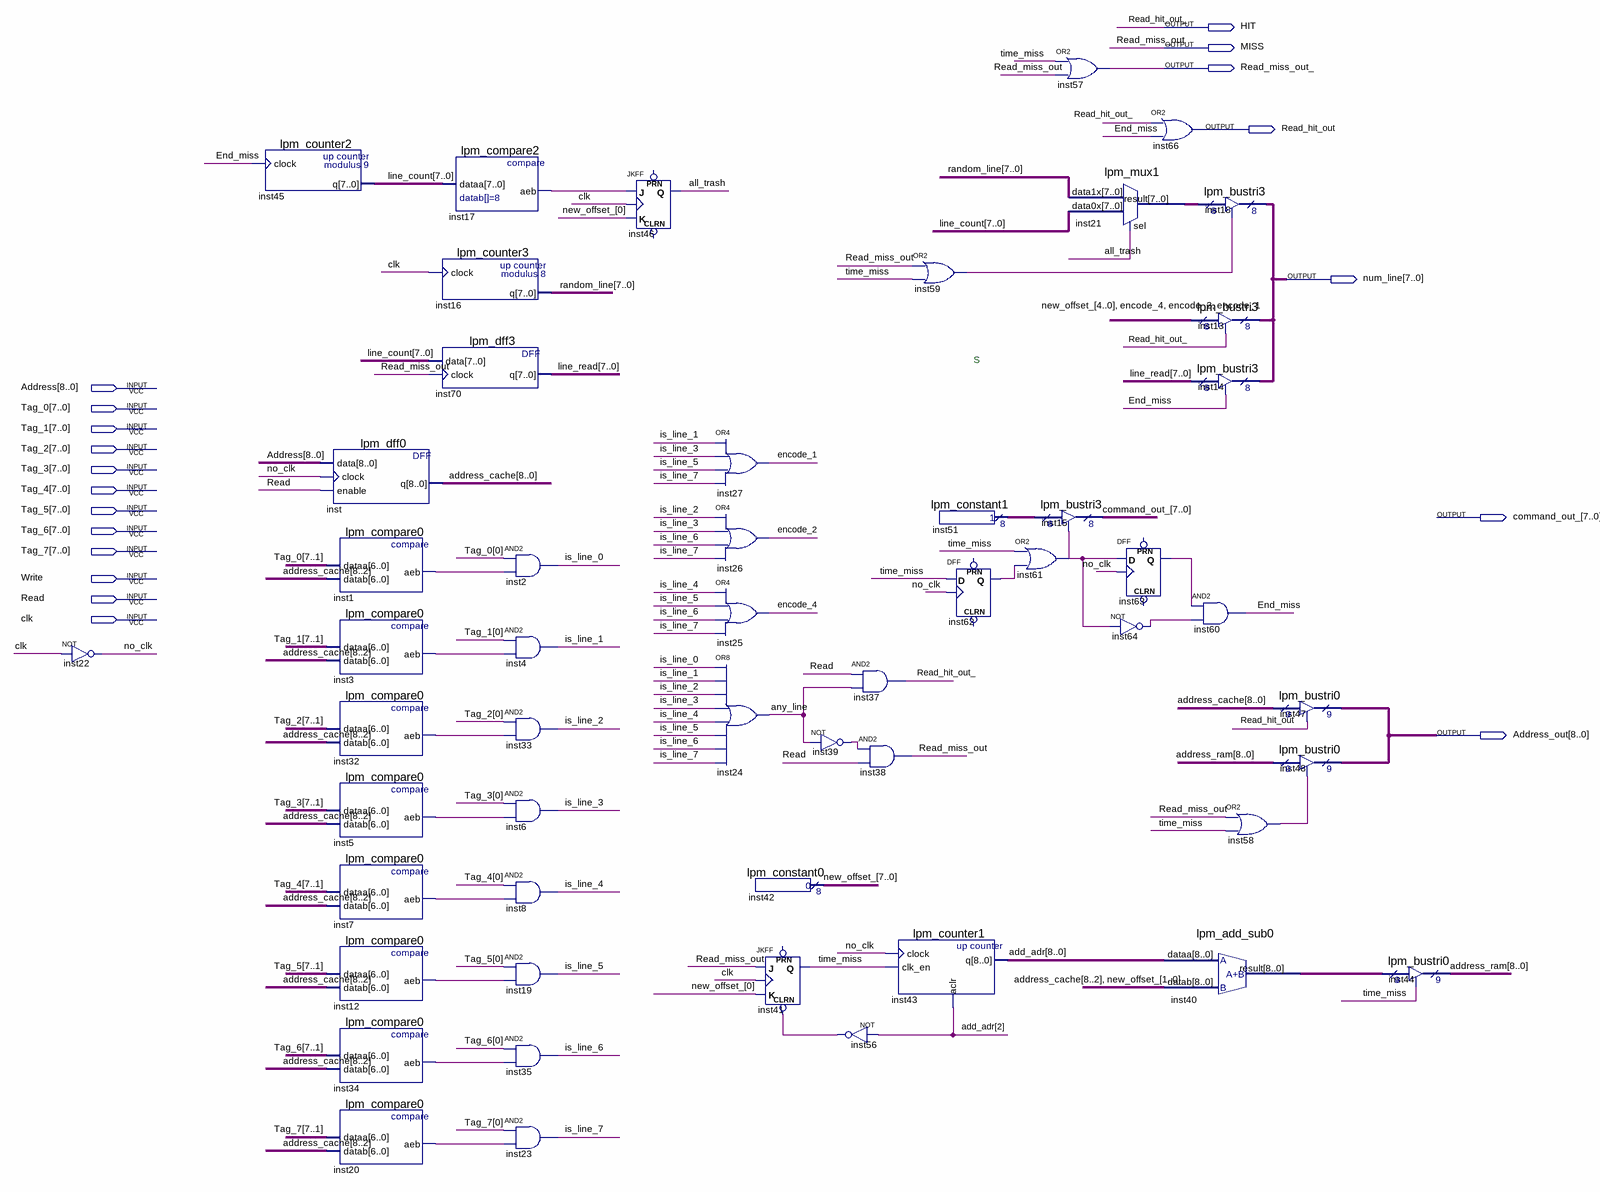
[diagram p0: schematic sheet]
// Quartus schematic cache_control.bdf as structural Verilog: 53 symbols, 19 pins
module cache_control (
  input  [8:0] Address,
  input  [7:0] Tag_0,
  input  [7:0] Tag_1,
  input  [7:0] Tag_2,
  input  [7:0] Tag_3,
  input  [7:0] Tag_4,
  input  [7:0] Tag_5,
  input  [7:0] Tag_6,
  input  [7:0] Tag_7,
  input  Write,
  input  Read,
  input  clk,
  output HIT,
  output MISS,
  output Read_miss_out_,
  output Read_hit_out,
  output [7:0] num_line,
  output [7:0] command_out_,
  output [8:0] Address_out
);

  wire all_trash, any_line, encode_1, encode_2, encode_4, End_miss, inst1_aeb, inst3_aeb, inst5_aeb,
       inst7_aeb, inst12_aeb, inst17_aeb, inst20_aeb, inst32_aeb, inst34_aeb, inst39_out, inst56_out,
       inst58_out, inst59_out, inst61_out, inst62_q, inst63_q, inst64_out, is_line_0, is_line_1, is_line_2,
       is_line_3, is_line_4, is_line_5, is_line_6, is_line_7, no_clk, time_miss;
  wire [7:0] inst21_result, inst51_result, line_count, line_read, new_offset_, random_line;
  wire [8:0] add_adr, address_cache, address_ram, inst40_result;

  not inst22 (no_clk, clk);
  lpm_counter2 inst45 (.clock(End_miss), .q(line_count));
  lpm_dff0 inst (.data(Address), .clock(no_clk), .enable(Read), .q(address_cache));
  lpm_compare0 inst1 (.dataa(Tag_0[7:1]), .datab(address_cache[8:2]), .aeb(inst1_aeb));
  lpm_compare0 inst3 (.dataa(Tag_1[7:1]), .datab(address_cache[8:2]), .aeb(inst3_aeb));
  lpm_compare0 inst32 (.dataa(Tag_2[7:1]), .datab(address_cache[8:2]), .aeb(inst32_aeb));
  lpm_compare0 inst5 (.dataa(Tag_3[7:1]), .datab(address_cache[8:2]), .aeb(inst5_aeb));
  lpm_compare0 inst7 (.dataa(Tag_4[7:1]), .datab(address_cache[8:2]), .aeb(inst7_aeb));
  lpm_compare0 inst12 (.dataa(Tag_5[7:1]), .datab(address_cache[8:2]), .aeb(inst12_aeb));
  lpm_compare0 inst34 (.dataa(Tag_6[7:1]), .datab(address_cache[8:2]), .aeb(inst34_aeb));
  lpm_compare0 inst20 (.dataa(Tag_7[7:1]), .datab(address_cache[8:2]), .aeb(inst20_aeb));
  lpm_counter3 inst16 (.clock(clk), .q(random_line));
  lpm_dff3 inst70 (.data(line_count), .clock(MISS), .q(line_read));
  lpm_compare2 inst17 (.dataa(line_count), .aeb(inst17_aeb));
  and inst2 (is_line_0, Tag_0[0], inst1_aeb);
  and inst4 (is_line_1, Tag_1[0], inst3_aeb);
  and inst33 (is_line_2, Tag_2[0], inst32_aeb);
  and inst6 (is_line_3, Tag_3[0], inst5_aeb);
  and inst8 (is_line_4, Tag_4[0], inst7_aeb);
  and inst19 (is_line_5, Tag_5[0], inst12_aeb);
  and inst35 (is_line_6, Tag_6[0], inst34_aeb);
  and inst23 (is_line_7, Tag_7[0], inst20_aeb);
  JKFF inst46 (.K(new_offset_[0]), .J(inst17_aeb), .CLK(clk), .Q(all_trash));  // open: PRN, CLRN
  or inst27 (encode_1, is_line_1, is_line_3, is_line_5, is_line_7);
  or inst26 (encode_2, is_line_2, is_line_3, is_line_6, is_line_7);
  or inst25 (encode_4, is_line_4, is_line_5, is_line_6, is_line_7);
  or inst24 (any_line, is_line_0, is_line_1, is_line_2, is_line_3, is_line_4, is_line_5, is_line_6, is_line_7);
  lpm_constant0 inst42 (.result(new_offset_));
  JKFF inst41 (.CLRN(inst56_out), .K(new_offset_[0]), .J(MISS), .CLK(clk), .Q(time_miss));  // open: PRN
  not inst39 (inst39_out, any_line);
  and inst37 (HIT, Read, any_line);
  and inst38 (MISS, inst39_out, Read);
  not inst56 (inst56_out, add_adr[2]);
  or inst59 (inst59_out, MISS, time_miss);
  lpm_counter1 inst43 (.clock(no_clk), .clk_en(time_miss), .aclr(add_adr[2]), .q(add_adr));
  lpm_constant1 inst51 (.result(inst51_result));
  DFF inst62 (.CLK(no_clk), .D(time_miss), .Q(inst62_q));  // open: CLRN, PRN
  or inst61 (inst61_out, time_miss, inst62_q);
  or inst57 (Read_miss_out_, time_miss, MISS);
  lpm_mux1 inst21 (.data1x(random_line), .data0x(line_count), .sel(all_trash), .result(inst21_result));
  lpm_bustri3 inst15 (.enabledt(inst61_out), .data(inst51_result), .tridata(command_out_));
  DFF inst63 (.CLK(no_clk), .D(inst61_out), .Q(inst63_q));  // open: CLRN, PRN
  not inst64 (inst64_out, inst61_out);
  or inst66 (Read_hit_out, HIT, End_miss);
  lpm_bustri3 inst13 (.enabledt(HIT), .data({new_offset_[4:0], encode_4, encode_2, encode_1}), .tridata(num_line));
  lpm_bustri3 inst14 (.enabledt(End_miss), .data(line_read), .tridata(num_line));
  and inst60 (End_miss, inst63_q, inst64_out);
  lpm_add_sub0 inst40 (.dataa(add_adr), .datab({address_cache[8:2], new_offset_[1:0]}), .result(inst40_result));
  lpm_bustri3 inst18 (.enabledt(inst59_out), .data(inst21_result), .tridata(num_line));
  or inst58 (inst58_out, MISS, time_miss);
  lpm_bustri0 inst47 (.enabledt(Read_hit_out), .data(address_cache), .tridata(Address_out));
  lpm_bustri0 inst48 (.enabledt(inst58_out), .data(address_ram), .tridata(Address_out));
  lpm_bustri0 inst44 (.enabledt(time_miss), .data(inst40_result), .tridata(address_ram));

  // Other names for the same wires on the sheet: Read_hit_out_ = HIT; Read_miss_out = MISS

  // Notes on the sheet:
  //   S
endmodule
